# EAGLE schematic mcu_v1 (EAGLE 6.5.0)
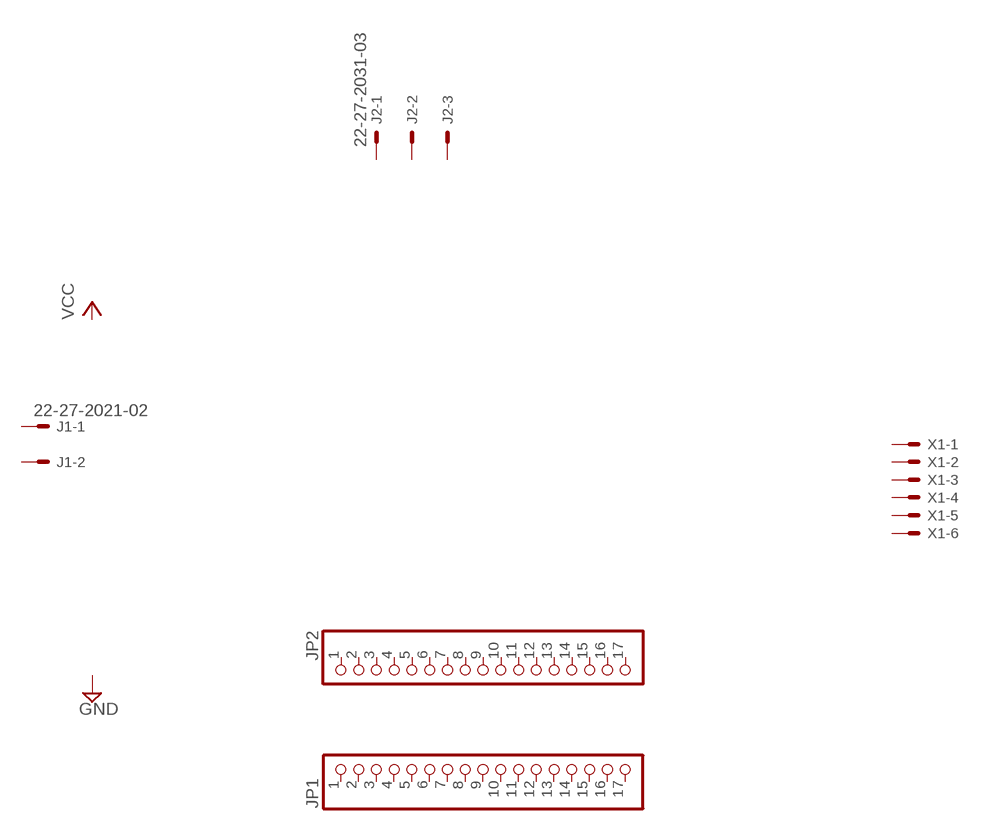
[diagram p0: schematic, sheet 1]

## Parts
J1  22-27-2021-02  [6410-02]
J2  22-27-2031-03  [6410-03]
JP1  PINHD-1X17  [1X17]
JP2  PINHD-1X17  [1X17]
X1  22-23-2061  [22-23-2061]
Unconnected: J1.1 J1.2 J2.1 J2.2 J2.3 JP1.1 JP1.2 JP1.3 JP1.4 JP1.5 JP1.6 JP1.7 JP1.8 JP1.9 JP1.10 JP1.11 JP1.12 JP1.13 JP1.14 JP1.15 JP1.16 JP1.17 JP2.1 JP2.2 JP2.3 JP2.4 JP2.5 JP2.6 JP2.7 JP2.8 JP2.9 JP2.10 JP2.11 JP2.12 JP2.13 JP2.14 JP2.15 JP2.16 JP2.17 X1.1 X1.2 X1.3 X1.4 X1.5 X1.6

## Library data of the parts
J1 = con-molex:22-?-02: CONNECTOR wire to board 2.54 mm (.1 inch) pitch header; OC_FARNELL: unknown; OC_NEWARK: unknown
J2 = con-molex:22-?-03: CONNECTOR wire to board 2.54 mm (.1 inch) pitch header; OC_FARNELL: unknown; OC_NEWARK: unknown
JP1 JP2 = pinhead:PINHD-1X17: PIN HEADER
X1 = con-molex:22-23-2061: .100" (2.54mm) Center Header - 6 Pin; MF: MOLEX; MPN: 22-23-2061; OC_FARNELL: 1462922; OC_NEWARK: 27C1933